# Altium schematic sheet 31.SchDoc
size 513 x 386 mm
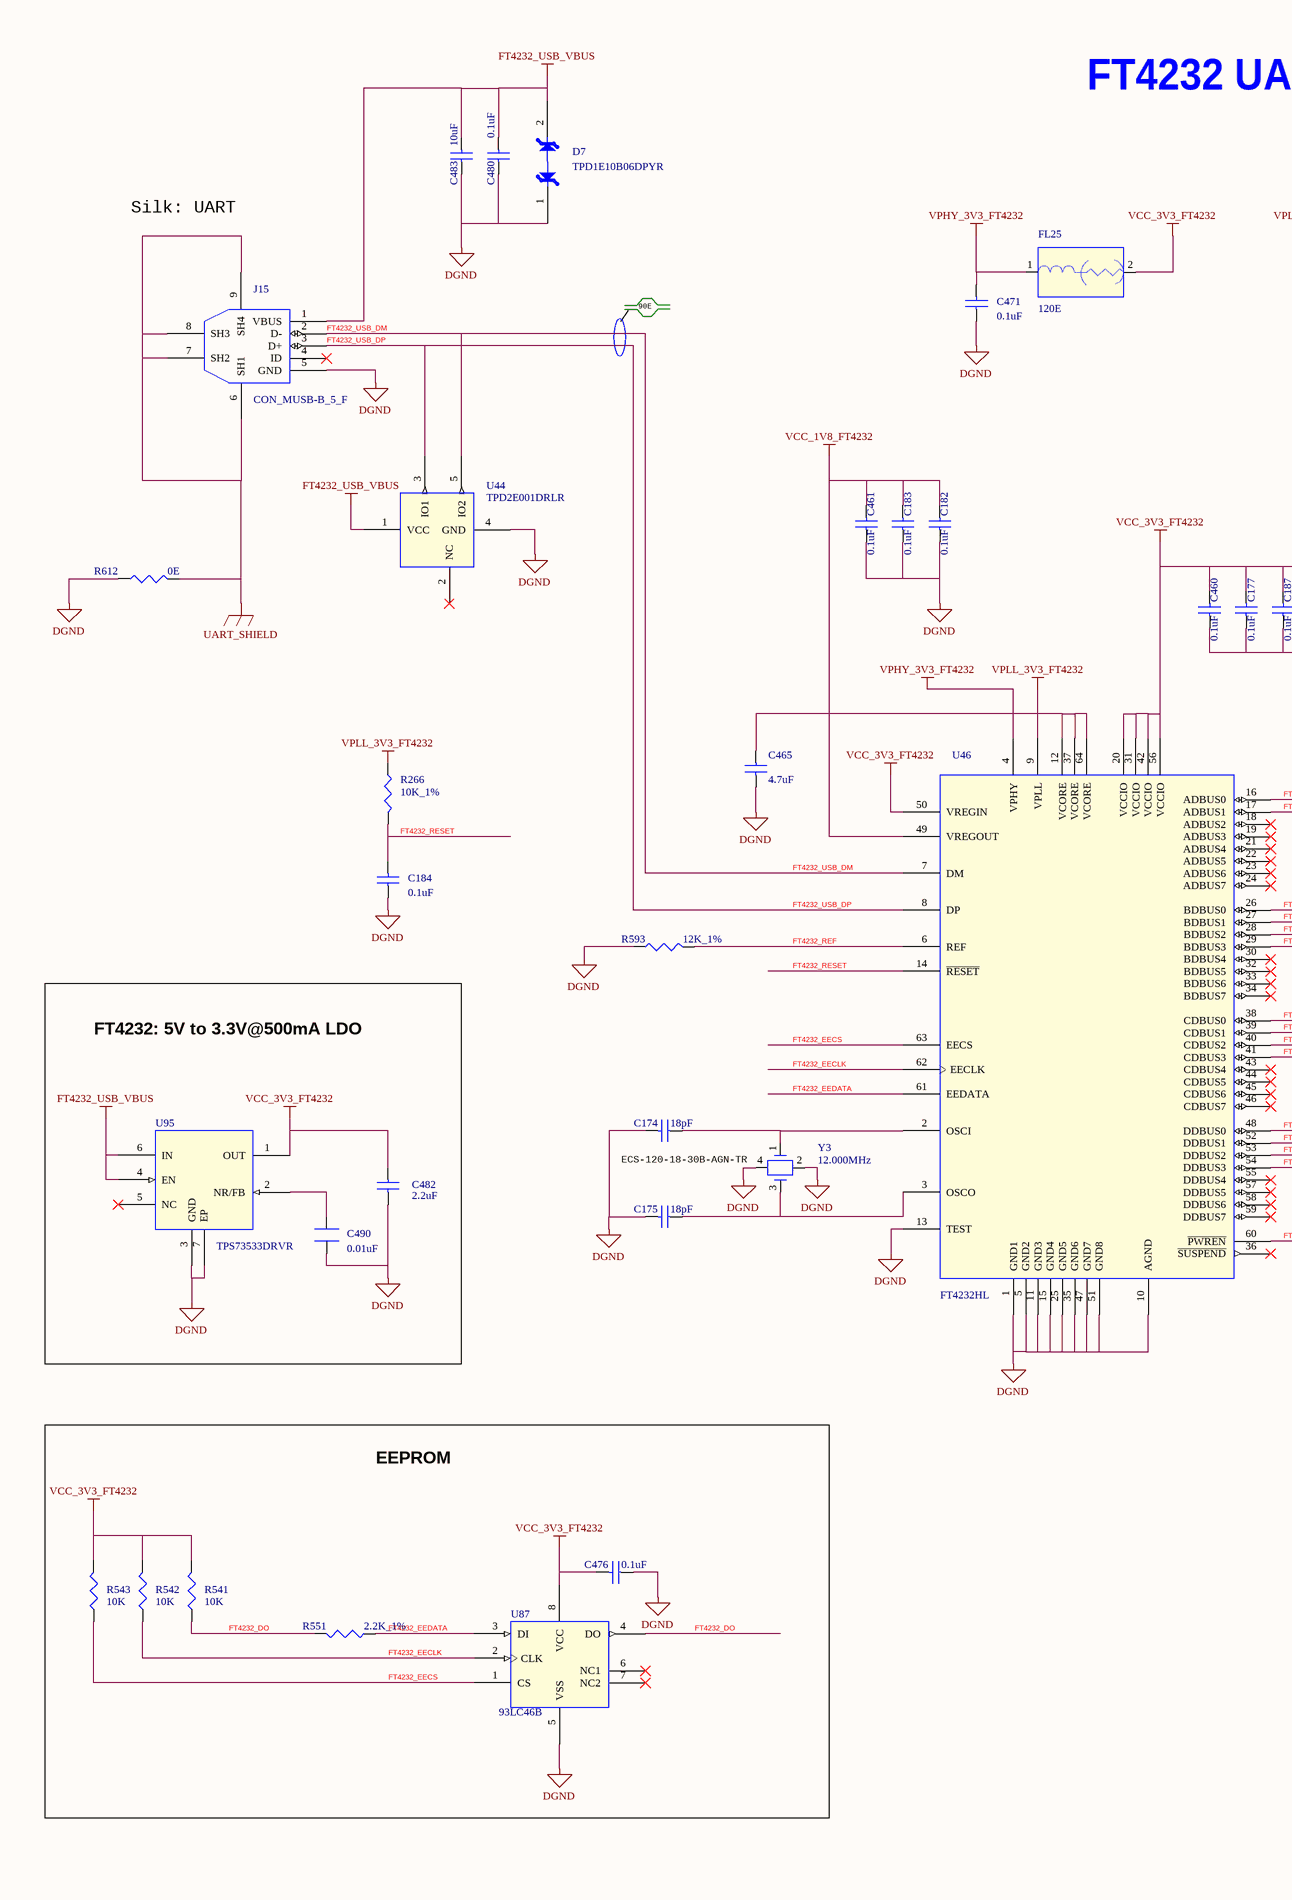
[diagram p0: 31.SchDoc, left]
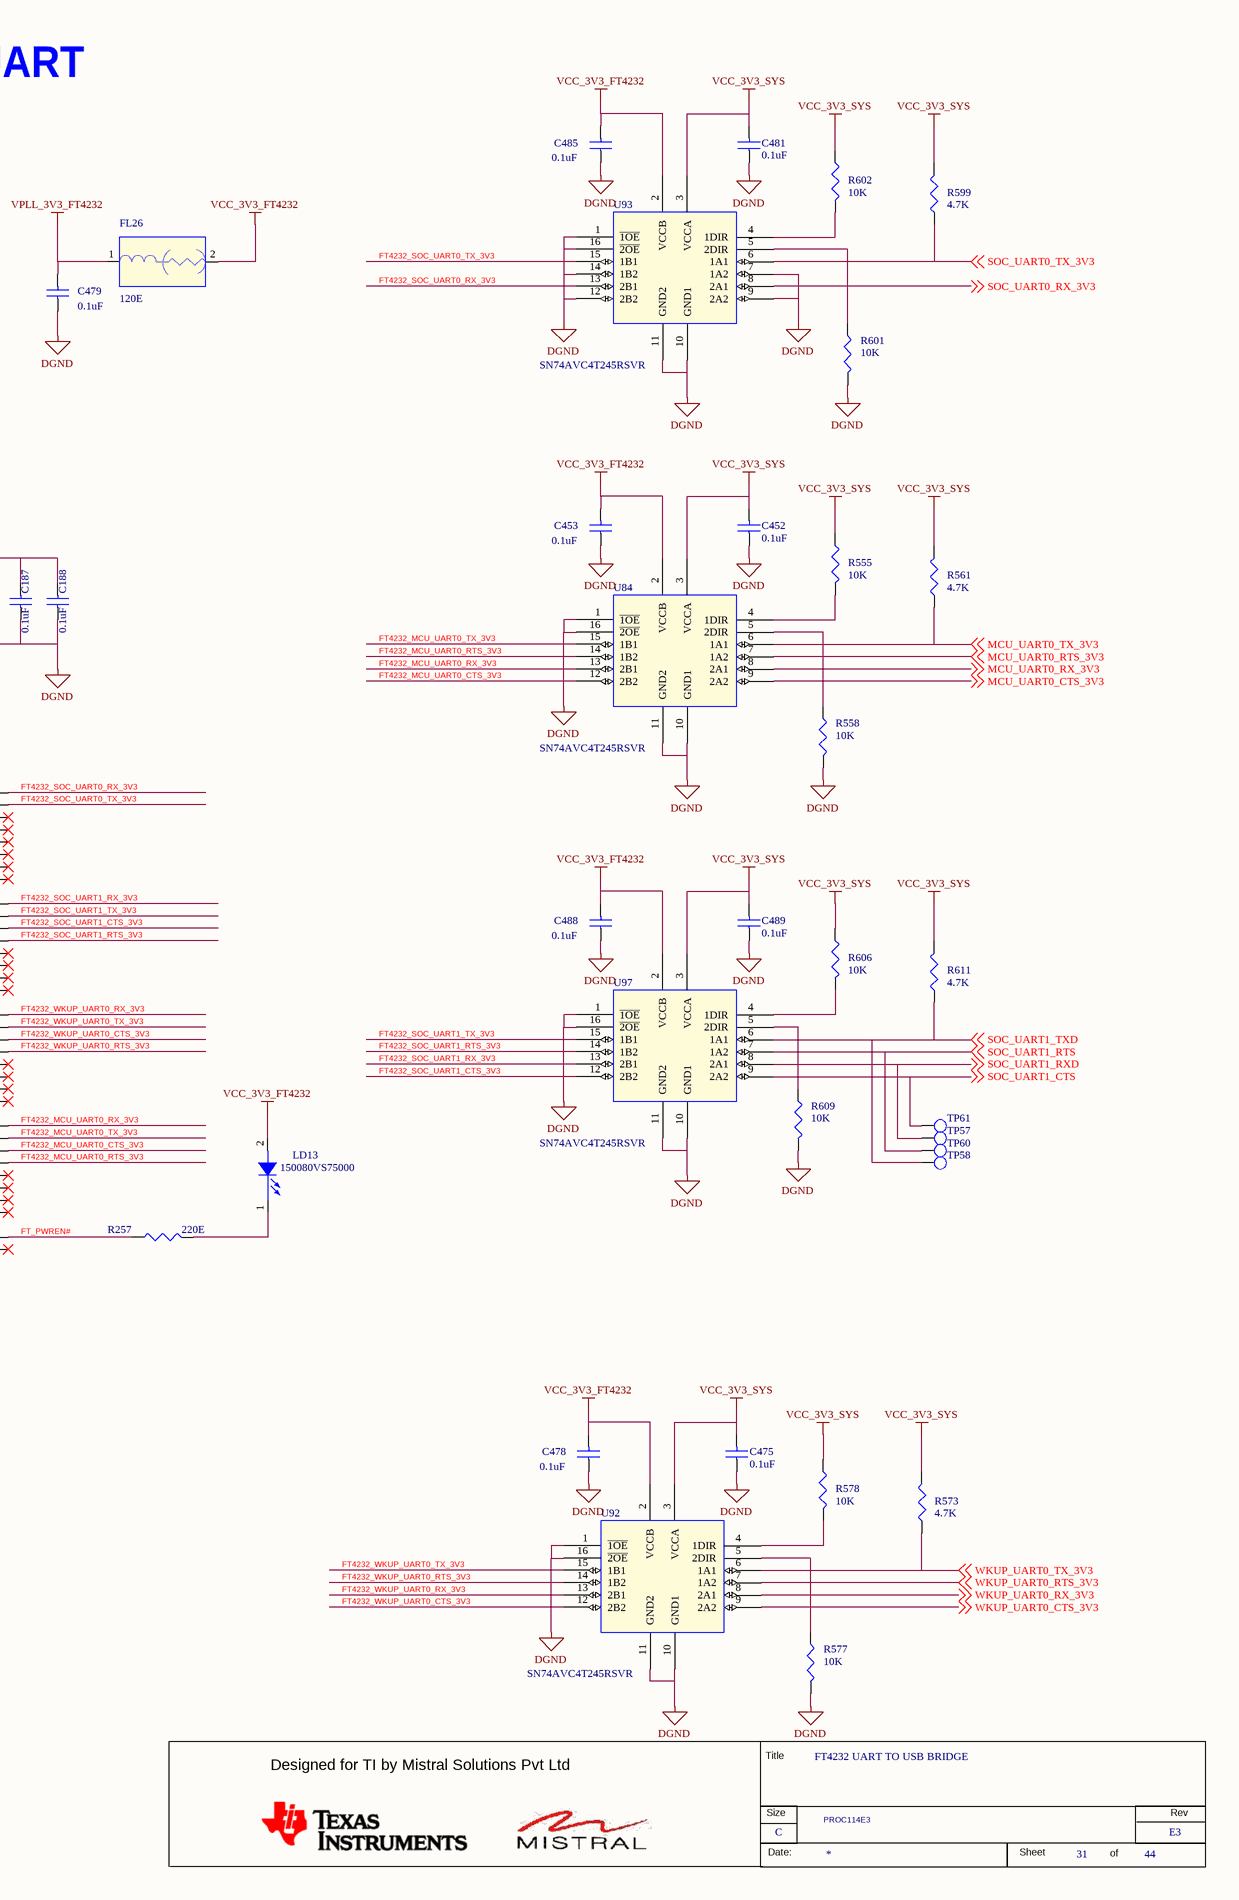
[diagram p1: 31.SchDoc, right]

## Parts
*  RevCode: E3  Title: FT4232 UART TO USB BRIDGE  Page Size: C  Page Number: 31  Page Count: 44  Variant Name: PROC114E3  (hidden comment: MISTRAL_TITLEBLK_CSIZE)  (graphical)
C174  18pF  [CAP0402_0-75]
C175  18pF  [CAP0402_0-75]
C177  0.1uF  [CAP0402_0-75]
C182  0.1uF  [CAP0402_0-75]
C183  0.1uF  [CAP0402_0-75]
C184  0.1uF  [CAP0201_0-5]
C187  0.1uF  [CAP0402_0-75]
C188  0.1uF  [CAP0402_0-75]
C452  0.1uF  [CAP0201_0-5]
C453  0.1uF  [CAP0201_0-5]
C460  0.1uF  [CAP0402_0-75]
C461  0.1uF  [CAP0402_0-75]
C465  4.7uF  [CAP0402_0-75]
C471  0.1uF  [CAP0402_0-75]
C475  0.1uF  [CAP0201_0-5]
C476  0.1uF  [CAP0402_0-75]
C478  0.1uF  [CAP0201_0-5]
C479  0.1uF  [CAP0402_0-75]
C480  0.1uF  [CAP0402_0-75]
C481  0.1uF  [CAP0201_0-5]
C482  2.2uF  [CAP0402_0-75]
C483  10uF  [CAP0402_0-75]
C485  0.1uF  [CAP0201_0-5]
C488  0.1uF  [CAP0201_0-5]
C489  0.1uF  [CAP0201_0-5]
C490  0.01uF  [CAP0402N]
D7  TPD1E10B06DPYR  [DIO_DFN0402_0-5]
FL25  120E  [EMIFIL_BLM15A_0402_0-6]
FL26  120E  [EMIFIL_BLM15A_0402_0-6]
J15  CON_MUSB-B_5_F  [CON_MUSBB5_629105150521_S_R_S_2-7]
LD13  150080VS75000  [LED_150080VS75000_80X50_SMD_0-8]
R257  220E  [RES0402_0-5]
R266  10K_1%  [RES0402N]
R541  10K  [RES0201_0-5]
R542  10K  [RES0201_0-5]
R543  10K  [RES0201_0-5]
R551  2.2K_1%  [RES0201_0-5]
R555  10K  [RES0201_0-5]
R558  10K  [RES0201_0-5]
R561  4.7K  [RES0201_0-5]
R573  4.7K  [RES0201_0-5]
R577  10K  [RES0201_0-5]
R578  10K  [RES0201_0-5]
R593  12K_1%  [RES0402_0-5]
R599  4.7K  [RES0201_0-5]
R601  10K  [RES0201_0-5]
R602  10K  [RES0201_0-5]
R606  10K  [RES0201_0-5]
R609  10K  [RES0201_0-5]
R611  4.7K  [RES0201_0-5]
R612  0E  [RES0805_0-75]
TP57  THRU HOLE  [TP_36X22]  (value not drawn)
TP58  THRU HOLE  [TP_36X22]  (value not drawn)
TP60  TP20_SMD  [TP20_SMD]  (value not drawn)
TP61  TP20_SMD  [TP20_SMD]  (value not drawn)
U44  TPD2E001DRLR  [SOT553-5_0-6]
U46  FT4232HL  [LQF64]
U84  SN74AVC4T245RSVR  [UQFN16_TMUX1574_70X100_0-6]
U87  93LC46B  [MSOP8_25-59_125X125_1-1]
U92  SN74AVC4T245RSVR  [UQFN16_TMUX1574_70X100_0-6]
U93  SN74AVC4T245RSVR  [UQFN16_TMUX1574_70X100_0-6]
U95  TPS73533DRVR  [SON6_25-59_85X85]
U97  SN74AVC4T245RSVR  [UQFN16_TMUX1574_70X100_0-6]
Y3  12.000MHz  [XTAL4_ECX-53BQ_200X130_SMD_0-9]

## Blocks framed on the sheet
FT4232: 5V to 3.3V@500mA LDO: C482 C490 U95
EEPROM: C476 R541-R543 R551 U87

## Nets
DGND: C174.2 C175.2 C177.1 C182.1 C183.1 C184.1 C187.1 C188.1 C452.1 C453.1 C460.1 C461.1 C465.2 C471.1 C475.1 C476.1 C478.1 C479.1 C480.1 C481.1 C482.2 C483.1 C485.1 C488.1 C489.1 C490.1 D7.1 J15.5(GND) R558.1 R577.1 R593.1 R601.1 R609.1 R612.1 U44.4(GND) U46.1(GND1) U46.5(GND2) U46.10(AGND) U46.11(GND3) U46.13(TEST) U46.15(GND4) U46.25(GND5) U46.35(GND6) U46.47(GND7) U46.51(GND8) U84.1(~{1OE}) U84.10(GND1) U84.11(GND2) U84.16(~{2OE}) U87.5(VSS) U92.1(~{1OE}) U92.10(GND1) U92.11(GND2) U92.16(~{2OE}) U93.1(~{1OE}) U93.7(1A2) U93.9(2A2) U93.10(GND1) U93.11(GND2) U93.12(2B2) U93.14(1B2) U93.16(~{2OE}) U95.3(GND) U95.7(EP) U97.1(~{1OE}) U97.10(GND1) U97.11(GND2) U97.16(~{2OE}) Y3.2 Y3.4
FT4232_USB_VBUS: C480.2 C483.2 D7.2 J15.1(VBUS) U44.1(VCC) U95.4(EN) U95.6(IN)
UART_SHIELD: J15.6(SH1) J15.7(SH2) J15.8(SH3) J15.9(SH4) R612.2
VCC_1V8_FT4232: C182.2 C183.2 C461.2 C465.1 U46.12(VCORE) U46.37(VCORE) U46.49(VREGOUT) U46.64(VCORE)
VCC_3V3_FT4232: C177.2 C187.2 C188.2 C453.2 C460.2 C476.2 C478.2 C482.1 C485.2 C488.2 FL25.2 FL26.2 LD13.2(ANODE) R541.2 R542.2 R543.2 U46.20(VCCIO) U46.31(VCCIO) U46.42(VCCIO) U46.50(VREGIN) U46.56(VCCIO) U84.2(VCCB) U87.8(VCC) U92.2(VCCB) U93.2(VCCB) U95.1(OUT) U97.2(VCCB)
VCC_3V3_SYS: C452.2 C475.2 C481.2 C489.2 R555.2 R561.1 R573.1 R578.2 R599.1 R602.2 R606.2 R611.1 U84.3(VCCA) U92.3(VCCA) U93.3(VCCA) U97.3(VCCA)
VPHY_3V3_FT4232: C471.2 FL25.1 U46.4(VPHY)
VPLL_3V3_FT4232: C479.2 FL26.1 R266.2 U46.9(VPLL)
FT4232_DO: R541.1 R551.2 U87.4(DO)
FT4232_EECLK: R542.1 U46.62(EECLK) U87.2(CLK)
FT4232_EECS: R543.1 U46.63(EECS) U87.1(CS)
FT4232_EEDATA: R551.1 U46.61(EEDATA) U87.3(DI)
FT4232_MCU_UART0_CTS_3V3: U46.53(DDBUS2) U84.12(2B2)
FT4232_MCU_UART0_RTS_3V3: U46.54(DDBUS3) U84.14(1B2)
FT4232_MCU_UART0_RX_3V3: U46.48(DDBUS0) U84.13(2B1)
FT4232_MCU_UART0_TX_3V3: U46.52(DDBUS1) U84.15(1B1)
FT4232_REF: R593.2 U46.6(REF)
FT4232_RESET: C184.2 R266.1 U46.14(~{RESET})
FT4232_SOC_UART0_RX_3V3: U46.16(ADBUS0) U93.13(2B1)
FT4232_SOC_UART0_TX_3V3: U46.17(ADBUS1) U93.15(1B1)
FT4232_SOC_UART1_CTS_3V3: U46.28(BDBUS2) U97.12(2B2)
FT4232_SOC_UART1_RTS_3V3: U46.29(BDBUS3) U97.14(1B2)
FT4232_SOC_UART1_RX_3V3: U46.26(BDBUS0) U97.13(2B1)
FT4232_SOC_UART1_TX_3V3: U46.27(BDBUS1) U97.15(1B1)
FT4232_USB_DM: J15.2(D-) U44.5(IO2) U46.7(DM)
FT4232_USB_DP: J15.3(D+) U44.3(IO1) U46.8(DP)
FT4232_WKUP_UART0_CTS_3V3: U46.40(CDBUS2) U92.12(2B2)
FT4232_WKUP_UART0_RTS_3V3: U46.41(CDBUS3) U92.14(1B2)
FT4232_WKUP_UART0_RX_3V3: U46.38(CDBUS0) U92.13(2B1)
FT4232_WKUP_UART0_TX_3V3: U46.39(CDBUS1) U92.15(1B1)
FT_PWREN#: R257.1 U46.60(~{PWREN})
MCU_UART0_CTS_3V3: U84.9(2A2) ; off-sheet MCU_UART0_CTS_3V3
MCU_UART0_RTS_3V3: U84.7(1A2) ; off-sheet MCU_UART0_RTS_3V3
MCU_UART0_RX_3V3: U84.8(2A1) ; off-sheet MCU_UART0_RX_3V3
MCU_UART0_TX_3V3: R561.2 U84.6(1A1) ; off-sheet MCU_UART0_TX_3V3
SOC_UART0_RX_3V3: U93.8(2A1) ; off-sheet SOC_UART0_RX_3V3
SOC_UART0_TX_3V3: R599.2 U93.6(1A1) ; off-sheet SOC_UART0_TX_3V3
SOC_UART1_CTS: TP61.1(TP) U97.9(2A2) ; off-sheet SOC_UART1_CTS
SOC_UART1_RTS: TP60.1(TP) U97.7(1A2) ; off-sheet SOC_UART1_RTS
SOC_UART1_RXD: TP57.1(TP) U97.8(2A1) ; off-sheet SOC_UART1_RXD
SOC_UART1_TXD: R611.2 TP58.1(TP) U97.6(1A1) ; off-sheet SOC_UART1_TXD
WKUP_UART0_CTS_3V3: U92.9(2A2) ; off-sheet WKUP_UART0_CTS_3V3
WKUP_UART0_RTS_3V3: U92.7(1A2) ; off-sheet WKUP_UART0_RTS_3V3
WKUP_UART0_RX_3V3: U92.8(2A1) ; off-sheet WKUP_UART0_RX_3V3
WKUP_UART0_TX_3V3: R573.2 U92.6(1A1) ; off-sheet WKUP_UART0_TX_3V3
NetC174_1: C174.1 U46.2(OSCI) Y3.1
NetC175_1: C175.1 U46.3(OSCO) Y3.3
NetC490_2: C490.2 U95.2(NR/FB)
NetLD13_1: LD13.1(CATHODE) R257.2
NetR555_1: R555.1 U84.4(1DIR)
NetR558_2: R558.2 U84.5(2DIR)
NetR577_2: R577.2 U92.5(2DIR)
NetR578_1: R578.1 U92.4(1DIR)
NetR601_2: R601.2 U93.5(2DIR)
NetR602_1: R602.1 U93.4(1DIR)
NetR606_1: R606.1 U97.4(1DIR)
NetR609_2: R609.2 U97.5(2DIR)

Not connected (* = marked no-connect by the designer): J15 4(ID)*; U44 2(NC)*; U46 18(ADBUS2)* 19(ADBUS3)* 21(ADBUS4)* 22(ADBUS5)* 23(ADBUS6)* 24(ADBUS7)* 30(BDBUS4)* 32(BDBUS5)* 33(BDBUS6)* 34(BDBUS7)* 36(~{SUSPEND})* 43(CDBUS4)* 44(CDBUS5)* 45(CDBUS6)* 46(CDBUS7)* 55(DDBUS4)* 57(DDBUS5)* 58(DDBUS6)* 59(DDBUS7)*; U87 6(NC1)* 7(NC2)*; U95 5(NC)*

## Notes on the sheet
- FT4232 UART
- Silk: UART
- 90E
- ECS-120-18-30B-AGN-TR
- (in symbol MISTRAL_TITLEBLK_CSIZE) Title; Designed for TI by Mistral Solutions Pvt Ltd; Size; Rev; Date:; Sheet; of

## Library data of the parts
* = MISTRAL_TITLEBLK_CSIZE: Issue: 1.0; Page Create Date: March  8, 1995; Page Modify Date: *; Schematic Page Count: 44; Schematic Page Number: 31
C174 = CAP_Dup2: CAP CERAMIC 18pF 50V 5% HI-Q C0G(NP0) 0402; Part_type: CAPACITORS\CERAMIC; Mfr_part_number: GJM1555C1H180JB01D; Mfr_name: MURATA; Mistral Part No: 120014100019-R; Custom_Duty: 15%; Customs_HS_Code: 85322990; Project: DC_MIST_RDC; Wattage: NA; Footprint Path: Y:\MIS_DATABASE\Library\ALTIUM_TOOL\PCB_FOOTPRINTS\Altium_Footprint_Lib.PcbLib; Library Path: Y:\MIS_DATABASE\Library\ALTIUM_TOOL\SCHEMATICS_PARTS\MS_DISCRETE_Library.schlib; MECHANICAL 3D STEP FILE: CAP0402_0-75; Footprint Ref: CAP0402_0-75; Library Ref: CAP; Chkd/date: VASANTHA/030315; Crtd /date: NAVEED/271014; Datasheet: Y:\MIS_DATABASE\DATASHEETS\CAPACITORS\MURATA-GXX-SER_NOV17.PDF; Height: 0.55MM; Distributor_part_number: 490-3119-1-ND; Distributor_name: DIGIKEY; Package: 0402; Voltage: 50V; Tolerance: 5%; Weight: 6mg; Temperature: -55°C+125°C; PCB Footprint: CAP0402_0-75
C175 = CAP_Dup2: CAP CERAMIC 18pF 50V 5% HI-Q C0G(NP0) 0402; Mistral Part No: 120014100019-R; Mfr_name: MURATA; Mfr_part_number: GJM1555C1H180JB01D; Part_type: CAPACITORS\CERAMIC; Project: DC_MIST_RDC; Customs_HS_Code: 85322990; Custom_Duty: 15%; Wattage: NA; Footprint Path: Y:\MIS_DATABASE\Library\ALTIUM_TOOL\PCB_FOOTPRINTS\Altium_Footprint_Lib.PcbLib; Library Path: Y:\MIS_DATABASE\Library\ALTIUM_TOOL\SCHEMATICS_PARTS\MS_DISCRETE_Library.schlib; MECHANICAL 3D STEP FILE: CAP0402_0-75; Footprint Ref: CAP0402_0-75; Library Ref: CAP; Tolerance: 5%; Voltage: 50V; Package: 0402; Distributor_name: DIGIKEY; Distributor_part_number: 490-3119-1-ND; Height: 0.55MM; Datasheet: Y:\MIS_DATABASE\DATASHEETS\CAPACITORS\MURATA-GXX-SER_NOV17.PDF; Crtd /date: NAVEED/271014; Chkd/date: VASANTHA/030315; Weight: 6mg; Temperature: -55°C+125°C; PCB Footprint: CAP0402_0-75
C177 C183 C188 C461 C471 C476 C479 C480 = CAP_Dup2: CAP CERAMIC 0.1uF 50V 10% X7R 0402; Alt_Mfr_part_number: CC0402KRX5R8BB104; Mistral Part No: 120011100014-R; Mfr_name: MURATA; Mfr_part_number: GRM155R71H104KE14D; Part_type: CAPACITORS\CERAMIC; Alt_Mfr_name: YAGEO AMERICA; Project: J7_CP; Wattage: NA; Customs_HS_Code: 85322990; Custom_Duty: 15%; Tolerance: 10%; Voltage: 50V; Package: 0402; Distributor_name: DIGIKEY; Distributor_part_number: 490-10700-1-ND; Height: 0.55MM; Weight: 3.1mg; Temperature: -55°C+125°C; Datasheet: Y:\MIS_DATABASE\DATASHEETS\CAPACITORS\GRM155R71H104KE14.PDF; Crtd /date: ALVY/211020; Chkd/date: MANIRAJA/261020; MECHANICAL 3D STEP FILE: CAP0402_0-75; Library Ref: CAP; Footprint Ref: CAP0402_0-75; Library Path: Y:\MIS_DATABASE\Library\ALTIUM_TOOL\SCHEMATICS_PARTS\MS_DISCRETE_Library.schlib; Footprint Path: Y:\MIS_DATABASE\Library\ALTIUM_TOOL\PCB_FOOTPRINTS\Altium_Footprint_Lib.PcbLib; PCB Footprint: CAP0402_0-75
C182 C187 C460 = CAP_Dup2: CAP CERAMIC 0.1uF 50V 10% X7R 0402; Alt_Mfr_name: YAGEO AMERICA; Part_type: CAPACITORS\CERAMIC; Mfr_part_number: GRM155R71H104KE14D; Mfr_name: MURATA; Mistral Part No: 120011100014-R; Alt_Mfr_part_number: CC0402KRX5R8BB104; Custom_Duty: 15%; Customs_HS_Code: 85322990; Wattage: NA; Project: J7_CP; Footprint Path: Y:\MIS_DATABASE\Library\ALTIUM_TOOL\PCB_FOOTPRINTS\Altium_Footprint_Lib.PcbLib; Library Path: Y:\MIS_DATABASE\Library\ALTIUM_TOOL\SCHEMATICS_PARTS\MS_DISCRETE_Library.schlib; Footprint Ref: CAP0402_0-75; Library Ref: CAP; MECHANICAL 3D STEP FILE: CAP0402_0-75; Chkd/date: MANIRAJA/261020; Crtd /date: ALVY/211020; Datasheet: Y:\MIS_DATABASE\DATASHEETS\CAPACITORS\GRM155R71H104KE14.PDF; Temperature: -55°C+125°C; Weight: 3.1mg; Height: 0.55MM; Distributor_part_number: 490-10700-1-ND; Distributor_name: DIGIKEY; Package: 0402; Voltage: 50V; Tolerance: 10%; PCB Footprint: CAP0402_0-75
C184 C475 C478 C488 C489 = CAP_Dup2: CAP CERAMIC 0.1uF 16V 10% X5R 0201; Alt_Mfr_name: YAGEO AMERICA; Part_type: CAPACITORS\CERAMIC; Mfr_part_number: GRM033R61C104KE14D; Mfr_name: MURATA; Mistral Part No: 120009030072-R; Alt_Mfr_part_number: CC0402KRX5R8BB104; Custom_Duty: 15%; Customs_HS_Code: 85322990; Wattage: NA; Project: TI_MAXIE_CPB; Footprint Path: Y:\MIS_DATABASE\Library\ALTIUM_TOOL\PCB_FOOTPRINTS\Altium_Footprint_Lib.PcbLib; Library Path: Y:\MIS_DATABASE\Library\ALTIUM_TOOL\SCHEMATICS_PARTS\MS_DISCRETE_Library.schlib; Footprint Ref: CAP0201_0-5; Library Ref: CAP; MECHANICAL 3D STEP FILE: CAP0201_0-5; Chkd/date: MANIRAJA/230118; Crtd /date: MANIRAJA/230118; Datasheet: Y:\MIS_DATABASE\DATASHEETS\CAPACITORS\GRM033R61C104KE14.PDF; Temperature: -55°C+85°C; Weight: 0.33mg; Height: 0.33MM; Distributor_part_number: 490-14305-1-ND; Distributor_name: DIGIKEY; Package: 0201; Voltage: 16V; Tolerance: 10%; PCB Footprint: CAP0201_0-5
C452 C453 C481 C485 = CAP_Dup2: CAP CERAMIC 0.1uF 16V 10% X5R 0201; Alt_Mfr_part_number: CC0402KRX5R8BB104; Mistral Part No: 120009030072-R; Mfr_name: MURATA; Mfr_part_number: GRM033R61C104KE14D; Part_type: CAPACITORS\CERAMIC; Alt_Mfr_name: YAGEO AMERICA; Project: TI_MAXIE_CPB; Wattage: NA; Customs_HS_Code: 85322990; Custom_Duty: 15%; Tolerance: 10%; Voltage: 16V; Package: 0201; Distributor_name: DIGIKEY; Distributor_part_number: 490-14305-1-ND; Height: 0.33MM; Weight: 0.33mg; Temperature: -55°C+85°C; Datasheet: Y:\MIS_DATABASE\DATASHEETS\CAPACITORS\GRM033R61C104KE14.PDF; Crtd /date: MANIRAJA/230118; Chkd/date: MANIRAJA/230118; MECHANICAL 3D STEP FILE: CAP0201_0-5; Library Ref: CAP; Footprint Ref: CAP0201_0-5; Library Path: Y:\MIS_DATABASE\Library\ALTIUM_TOOL\SCHEMATICS_PARTS\MS_DISCRETE_Library.schlib; Footprint Path: Y:\MIS_DATABASE\Library\ALTIUM_TOOL\PCB_FOOTPRINTS\Altium_Footprint_Lib.PcbLib; PCB Footprint: CAP0201_0-5
C465 = CAP_Dup2: CAP CERAMIC 4.7uF 10V 20% X5R 0402; Part_type: CAPACITORS\CERAMIC; Mfr_part_number: GRM155R61A475MEAAD; Mfr_name: MURATA; Mistral Part No: 120012060002-R; Custom_Duty: 15%; Customs_HS_Code: 85322990; Wattage: NA; Project: TI_J7SVB_PCIE_ADD-ON-CARD; Footprint Path: Y:\MIS_DATABASE\Library\ALTIUM_TOOL\PCB_FOOTPRINTS\Altium_Footprint_Lib.PcbLib; Library Path: Y:\MIS_DATABASE\Library\ALTIUM_TOOL\SCHEMATICS_PARTS\MS_DISCRETE_Library.schlib; MECHANICAL 3D STEP FILE: CAP0402_0-75; Chkd/date: MANIRAJA/110718; Crtd /date: ALVY/110718; Datasheet: Y:\MIS_DATABASE\DATASHEETS\CAPACITORS\GRM155R61A475MEAAD.PDF; Temperature: -55°C+85°C; Weight: 14mg; Height: 0.65MM; Footprint Ref: CAP0402_0-75; Library Ref: CAP; Distributor_part_number: 490-14306-1-ND; Distributor_name: DIGIKEY; Package: 0402; Voltage: 10V; Tolerance: 20%; PCB Footprint: CAP0402_0-75
C482 = CAP_Dup2: CAP CERAMIC 2.2uF 25V 10% X5R 0402; Mistral Part No: 120015120001-R; Mfr_name: MURATA; Mfr_part_number: GRM155R61E225KE11D; Part_type: CAPACITORS\CERAMIC; Project: TI_AM263X_CC; Wattage: NA; Customs_HS_Code: 85322990; Custom_Duty: 15%; Footprint Path: Y:\MIS_DATABASE\Library\ALTIUM_TOOL\PCB_FOOTPRINTS\Altium_Footprint_Lib.PcbLib; Library Path: Y:\MIS_DATABASE\Library\ALTIUM_TOOL\SCHEMATICS_PARTS\MS_DISCRETE_Library.schlib; Footprint Ref: CAP0402_0-75; Library Ref: CAP; Tolerance: 10%; Voltage: 25V; Package: 0402; Distributor_name: DIGIKEY; Distributor_part_number: 490-12703-1-ND; Height: 0.70MM; Weight: 1.5mg; Temperature: -55°C+85°C; Datasheet: Y:\MIS_DATABASE\DATASHEETS\CAPACITORS\GRM155R61E225KE11.PDF; Crtd /date: MANIRAJA/010721; Chkd/date: ALVY/010721; MECHANICAL 3D STEP FILE: CAP0402_0-75; PCB Footprint: CAP0402_0-75
C483 = CAP_Dup2: CAP CERAMIC 10uF 10V 20% X5R 0402; Part_type: CAPACITORS\CERAMIC; Mfr_part_number: GRM155R61A106ME11D; Mfr_name: MURATA; Mistral Part No: 120013110019-R; Custom_Duty: 15%; Customs_HS_Code: 85322990; Project: QCS610_NANOSOM; Wattage: NA; Footprint Path: Y:\MIS_DATABASE\Library\ALTIUM_TOOL\PCB_FOOTPRINTS\Altium_Footprint_Lib.PcbLib; Library Path: Y:\MIS_DATABASE\Library\ALTIUM_TOOL\SCHEMATICS_PARTS\MS_DISCRETE_Library.schlib; Footprint Ref: CAP0402_0-75; Chkd/date: MANIRAJA/300520; Crtd /date: ALVY/260520; Datasheet: Y:\MIS_DATABASE\DATASHEETS\CAPACITORS\MURATA-GXX-SER_NOV17.PDF; Height: 0.55MM; Distributor_part_number: 490-GRM155R61A106ME11DTR-ND; Distributor_name: DIGIKEY; Package: 0402; Voltage: 10V; Tolerance: 20%; Weight: 3.1mg; Temperature: -55°C+85°C; MECHANICAL 3D STEP FILE: CAP0402_0-75; Library Ref: CAP; PCB Footprint: CAP0402_0-75
C490 = CAP_Dup3: CAP CERAMIC 0.01uF 25V 10% X5R 0201; Part_type: CAPACITORS\CERAMIC; Mfr_part_number: GRM033R61E103KA12J; Mfr_name: MURATA; Mistral Part No: 120018010007-R; MECHANICAL 3D STEP FILE: CAP0201_0-5; Wattage: NA; Custom_Duty: 15%; Customs_HS_Code: 85322990; Project: TI_MAXIE_CPB; Footprint Path: Y:\MIS_DATABASE\Library\ALTIUM_TOOL\PCB_FOOTPRINTS\Altium_Footprint_Lib.PcbLib; Library Path: Y:\MIS_DATABASE\Library\ALTIUM_TOOL\SCHEMATICS_PARTS\MS_DISCRETE_Library.schlib; Footprint Ref: CAP0201_0-5; Temperature: -55°C+85°C; Weight: 0.33mg; Chkd/date: MANIRAJA/230118; Crtd /date: MANIRAJA/230118; Datasheet: Y:\MIS_DATABASE\DATASHEETS\CAPACITORS\GRM033R61E103KA12.PDF; Height: 0.33MM; Distributor_part_number: GRM033R61E103KA12J-ND; Distributor_name: DIGIKEY; Package: 0201; Voltage: 25V; Tolerance: 10%; Library Ref: CAP; PCB Footprint: CAP0201_0-5
D7 = DIODE_SOD323: DIODE 1CH ESD PROTECTION X1SON2; Mistral Part No: 130014110022-R; Mfr_name: TEXAS INSTRUMENTS; Project: GALILEO_EVM; Tolerance: NA; Customs_HS_Code: 85423100; Custom_Duty: 15%; Footprint Ref: DIO_DFN0402_0-5; Mfr_part_number: TPD1E10B06DPYR; Part_type: DIODE; Voltage: NA; Wattage: NA; Package: X1SON2; Distributor_name: DIGIKEY; Distributor_part_number: 296-30406-1-ND; Library Ref: DIODE_SOD323; Height: 0.45MM; Weight: 1mg; Temperature: -40°C+125°C; Datasheet: Y:\MIS_DATABASE\DATASHEETS\ICS\INTERFACE\TPD1E10B06-SER.PDF; Crtd /date: VASANTHA/181114; Chkd/date: MANIRAJA/040420; MECHANICAL 3D STEP FILE: DIO_DFN0402_0-5; Library Path: Y:\MIS_DATABASE\Library\ALTIUM_TOOL\SCHEMATICS_PARTS\MS_DISCRETE_Library.schlib; Footprint Path: Y:\MIS_DATABASE\Library\ALTIUM_TOOL\PCB_FOOTPRINTS\Altium_Footprint_Lib.PcbLib; PCB Footprint: DIO_DFN0402_0-5
FL25 FL26 = EMIFILTER_IND: IND FERRITE BEAD CHIP 120E 2A 0402; Part_type: INDUCTOR; Mfr_part_number: BLM15PX121SN1D; Mfr_name: MURATA; Mistral Part No: 130013060022-R; Custom_Duty: 24%; Customs_HS_Code: 85369090; Wattage: NA; Tolerance: 25%; Project: GEN_3-8; Footprint Path: Y:\MIS_DATABASE\Library\ALTIUM_TOOL\PCB_FOOTPRINTS\Altium_Footprint_Lib.PcbLib; Library Path: Y:\MIS_DATABASE\Library\ALTIUM_TOOL\SCHEMATICS_PARTS\MS_FILTER_Library.schlib; MECHANICAL 3D STEP FILE: EMIFIL_BLM15A_0402_0-6; Chkd/date: NAVEED/241114; Crtd /date: USMAN/170613; Datasheet: Y:\MIS_DATABASE\DATASHEETS\DISCRETES\INDUCTORS\BLM15-SN1-SER.PDF; Temperature: -55°C+125°C; Weight: 1mg; Height: 0.55MM; Library Ref: EMIFILTER_IND; Distributor_part_number: 490-9656-1-ND; Distributor_name: DIGIKEY; Package: 0402; Voltage: NA; Footprint Ref: EMIFIL_BLM15A_0402_0-6; PCB Footprint: EMIFIL_BLM15A_0402_0-6
J15 = CON_USB_MINI-B: CON MICRO USB TYPE B 5POS FEMALE RT SMD; Part_type: CONNECTOR\USB; Mfr_part_number: 629105150521; Mfr_name: WURTH ELECTRONICS; Mistral Part No: 150019050015-R; Custom_Duty: 24%; Customs_HS_Code: 85369090; Wattage: NA; Project: NEXTNAV_ALT-STATION_ATE_BRD; Footprint Path: Y:\MIS_DATABASE\Library\ALTIUM_TOOL\PCB_FOOTPRINTS\Altium_Footprint_Lib.PcbLib; Library Path: Y:\MIS_DATABASE\Library\ALTIUM_TOOL\SCHEMATICS_PARTS\MS_CONNECTOR_Library.schlib; MECHANICAL 3D STEP FILE: CON_MUSBB5_629105150521_S_R_S_2-7; Chkd/date: MANIRAJA/150519; Crtd /date: ALVY/150519; Datasheet: Y:\MIS_DATABASE\DATASHEETS\CONNECTORS\629105150521.PDF; Temperature: -40°C+85°C; Weight: 360mg; Height: 2.66MM; Footprint Ref: CON_MUSBB5_629105150521_S_R_S_2-7; Library Ref: CON_USB_MINI-B; Distributor_part_number: 732-5960-1-ND; Distributor_name: DIGIKEY; Package: SMD; Voltage: NA; Tolerance: NA; PCB Footprint: CON_MUSBB5_629105150521_S_R_S_2-7
LD13 = DIODE_LED: DIODE LED BRIGHT GREEN SMD; Mistral Part No: 130020080012-R; Mfr_name: WURTH ELECTRONICS; Part_type: OPTO\LED; Project: AM64x_EVM_BRD; Tolerance: NA; Customs_HS_Code: 85439000; Custom_Duty: 24%; Footprint Ref: LED_150080VS75000_80X50_SMD_0-8; Mfr_part_number: 150080VS75000; Voltage: NA; Wattage: NA; Package: SMD; Distributor_name: DIGIKEY; Distributor_part_number: 732-4986-1-ND; Library Ref: DIODE_LED; Height: 0.80MM; Weight: 10mg; Temperature: -40°C+85°C; Datasheet: Y:\MIS_DATABASE\DATASHEETS\DISCRETES\LEDS\150080VS75000.PDF; Crtd /date: ALVY/180820; Chkd/date: MANIRAJA/180820; MECHANICAL 3D STEP FILE: LED_150080VS75000_80X50_SMD_0-8; Library Path: Y:\MIS_DATABASE\Library\ALTIUM_TOOL\SCHEMATICS_PARTS\MS_OPTO_Library.schlib; Footprint Path: Y:\MIS_DATABASE\Library\ALTIUM_TOOL\PCB_FOOTPRINTS\Altium_Footprint_Lib.PcbLib; PCB Footprint: LED_150080VS75000_80X50_SMD_0-8
R257 = RESISTOR_Dup6: RES 220E 1/10W 5% 0402; Part_type: RESISTORS\FIXED; Mfr_part_number: ERJ-2GEJ221X; Mfr_name: PANASONIC-ECG; Mistral Part No: 110009030506-R; Voltage: NA; Custom_Duty: 15%; Customs_HS_Code: 85332119; Project: RED EYE; Footprint Ref: RES0402_0-5; Footprint Path: Y:\MIS_DATABASE\Library\ALTIUM_TOOL\PCB_FOOTPRINTS\Altium_Footprint_Lib.PcbLib; Library Path: Y:\MIS_DATABASE\Library\ALTIUM_TOOL\SCHEMATICS_PARTS\MS_DISCRETE_Library.schlib; MECHANICAL 3D STEP FILE: RES0402_0-5; Temperature: -55°C+155°C; Weight: 0.8mg; Chkd/date: VASANTHA/291216; Crtd /date: GEETHA/260406; Datasheet: Y:\MIS_DATABASE\DATASHEETS\RESISTORS\PAN-ERJSER_NOV17.PDF; Height: 0.40MM; Distributor_part_number: P220JCT-ND; Distributor_name: DIGIKEY; Package: 0402; Wattage: 1/10W; Tolerance: 5%; Library Ref: RESISTOR; PCB Footprint: RES0402_0-5
R266 = RESISTOR_Dup3: RES 10K 1/20W 1% 0201; Part_type: RESISTORS\FIXED; Mfr_part_number: RC0201FR-0710KL; Mfr_name: YAGEO AMERICA; Mistral Part No: 110011040018-R; Custom_Duty: 15%; Customs_HS_Code: 85332119; Project: GOLDEN-I LITE; Voltage: NA; MECHANICAL 3D STEP FILE: RES0201_0-5; Footprint Path: Y:\MIS_DATABASE\Library\ALTIUM_TOOL\PCB_FOOTPRINTS\Altium_Footprint_Lib.PcbLib; Library Path: Y:\MIS_DATABASE\Library\ALTIUM_TOOL\SCHEMATICS_PARTS\MS_DISCRETE_Library.schlib; Footprint Ref: RES0201_0-5; Library Ref: RESISTOR; Chkd/date: VASANTHA/270117; Crtd /date: MANIRAJA/270117; Datasheet: Y:\MIS_DATABASE\DATASHEETS\RESISTORS\RCXXXXL-SER_MAR18.PDF; Height: 0.26MM; Distributor_part_number: 311-10.0KMCT-ND; Distributor_name: DIGIKEY; Package: 0201; Wattage: 1/20W; Tolerance: 1%; Weight: 0.17mg; Temperature: -55°C+125°C; PCB Footprint: RES0201_0-5
R541 R542 R555 R577 R601 R602 = RESISTOR_Dup6: RES 10K 1/20W 5% 0201; Mistral Part No: 110010070051-R; Mfr_name: YAGEO AMERICA; Mfr_part_number: RC0201JR-0710KL; Part_type: RESISTORS\FIXED; Project: GOLDEN-I LITE; Voltage: NA; Customs_HS_Code: 85332119; Custom_Duty: 15%; Tolerance: 5%; Wattage: 1/20W; Package: 0201; Distributor_name: DIGIKEY; Distributor_part_number: 311-10KNCT-ND; Height: 0.26MM; Weight: 0.17mg; Temperature: -55°C+125°C; Datasheet: Y:\MIS_DATABASE\DATASHEETS\RESISTORS\RCXXXXL-SER_MAR18.PDF; Crtd /date: MANIRAJA/050517; Chkd/date: MANIRAJA/050517; MECHANICAL 3D STEP FILE: RES0201_0-5; Library Ref: RESISTOR; Footprint Ref: RES0201_0-5; Library Path: Y:\MIS_DATABASE\Library\ALTIUM_TOOL\SCHEMATICS_PARTS\MS_DISCRETE_Library.schlib; Footprint Path: Y:\MIS_DATABASE\Library\ALTIUM_TOOL\PCB_FOOTPRINTS\Altium_Footprint_Lib.PcbLib; PCB Footprint: RES0201_0-5
R543 R558 R578 R606 R609 = RESISTOR_Dup6: RES 10K 1/20W 5% 0201; Part_type: RESISTORS\FIXED; Mfr_part_number: RC0201JR-0710KL; Mfr_name: YAGEO AMERICA; Mistral Part No: 110010070051-R; Custom_Duty: 15%; Customs_HS_Code: 85332119; Voltage: NA; Project: GOLDEN-I LITE; MECHANICAL 3D STEP FILE: RES0201_0-5; Chkd/date: MANIRAJA/050517; Crtd /date: MANIRAJA/050517; Datasheet: Y:\MIS_DATABASE\DATASHEETS\RESISTORS\RCXXXXL-SER_MAR18.PDF; Temperature: -55°C+125°C; Weight: 0.17mg; Height: 0.26MM; Distributor_part_number: 311-10KNCT-ND; Distributor_name: DIGIKEY; Package: 0201; Wattage: 1/20W; Tolerance: 5%; Library Ref: RESISTOR; Footprint Ref: RES0201_0-5; Library Path: Y:\MIS_DATABASE\Library\ALTIUM_TOOL\SCHEMATICS_PARTS\MS_DISCRETE_Library.schlib; Footprint Path: Y:\MIS_DATABASE\Library\ALTIUM_TOOL\PCB_FOOTPRINTS\Altium_Footprint_Lib.PcbLib; PCB Footprint: RES0201_0-5
R551 = RESISTOR_Dup6: RES 2.2K 1/20W 1% 0201; Manufacturer: YAGEO AMERICA; Mistral Part No: 110017010016-R; Mfr_name: PANASONIC-ECG; Mfr_part_number: RC0201FR-072K2L; Part_type: RESISTORS\FIXED; Project: GOLDEN-I LITE; Voltage: NA; Customs_HS_Code: 85332119; Custom_Duty: 15%; Library Ref: RESISTOR; Tolerance: 1%; Wattage: 1/20W; Package: 0201; Distributor_name: DIGIKEY; Distributor_part_number: YAG2572CT-ND; Height: 0.26MM; Weight: 0.17mg; Temperature: -55°C+125°C; Datasheet: Y:\MIS_DATABASE\DATASHEETS\RESISTORS\RCXXXXL-SER_MAR18.PDF; Crtd /date: MANIRAJA/270117; Chkd/date: VASANTHA/270117; MECHANICAL 3D STEP FILE: RES0201_0-5; Footprint Path: Y:\MIS_DATABASE\Library\ALTIUM_TOOL\PCB_FOOTPRINTS\Altium_Footprint_Lib.PcbLib; Footprint Ref: RES0201_0-5; Library Path: Y:\MIS_DATABASE\Library\ALTIUM_TOOL\SCHEMATICS_PARTS\MS_DISCRETE_Library.schlib; PCB Footprint: RES0201_0-5
R561 R599 = RESISTOR_Dup6: RES 4.7K 1/20W 5% 0201; Part_type: RESISTORS\FIXED; Mfr_part_number: RC0201JR-074K7L; Mfr_name: YAGEO AMERICA; Mistral Part No: 110021090007-R; Custom_Duty: 15%; Customs_HS_Code: 85332119; Voltage: NA; Project: TI_AM62x SKEVM_BRD; Footprint Path: Y:\MIS_DATABASE\Library\ALTIUM_TOOL\PCB_FOOTPRINTS\Altium_Footprint_Lib.PcbLib; Library Path: Y:\MIS_DATABASE\Library\ALTIUM_TOOL\SCHEMATICS_PARTS\MS_DISCRETE_Library.schlib; MECHANICAL 3D STEP FILE: RES0201_0-5; Chkd/date: MANIRAJA/200921; Crtd /date: ALVY/200921; Datasheet: Y:\MIS_DATABASE\DATASHEETS\RESISTORS\RCXXXXL-SER_MAR18.PDF; Temperature: -55°C+125°C; Weight: 0.17mg; Height: 0.26MM; Footprint Ref: RES0201_0-5; Library Ref: RESISTOR; Distributor_part_number: 311-4.7KNCT-ND; Distributor_name: DIGIKEY; Package: 0201; Wattage: 1/20W; Tolerance: 5%; PCB Footprint: RES0201_0-5
R573 R611 = RESISTOR_Dup6: RES 4.7K 1/20W 5% 0201; Mistral Part No: 110021090007-R; Mfr_name: YAGEO AMERICA; Mfr_part_number: RC0201JR-074K7L; Part_type: RESISTORS\FIXED; Project: TI_AM62x SKEVM_BRD; Voltage: NA; Customs_HS_Code: 85332119; Custom_Duty: 15%; Tolerance: 5%; Wattage: 1/20W; Package: 0201; Distributor_name: DIGIKEY; Distributor_part_number: 311-4.7KNCT-ND; Library Ref: RESISTOR; Footprint Ref: RES0201_0-5; Height: 0.26MM; Weight: 0.17mg; Temperature: -55°C+125°C; Datasheet: Y:\MIS_DATABASE\DATASHEETS\RESISTORS\RCXXXXL-SER_MAR18.PDF; Crtd /date: ALVY/200921; Chkd/date: MANIRAJA/200921; MECHANICAL 3D STEP FILE: RES0201_0-5; Library Path: Y:\MIS_DATABASE\Library\ALTIUM_TOOL\SCHEMATICS_PARTS\MS_DISCRETE_Library.schlib; Footprint Path: Y:\MIS_DATABASE\Library\ALTIUM_TOOL\PCB_FOOTPRINTS\Altium_Footprint_Lib.PcbLib; PCB Footprint: RES0201_0-5
R593 = RESISTOR_Dup6: RES 12K 1/10W 1% 0402; Part_type: RESISTORS\FIXED; Mfr_part_number: ERJ-2RKF1202X; Mfr_name: PANASONIC-ECG; Mistral Part No: 110019040053-R; Custom_Duty: 15%; Customs_HS_Code: 85332119; Voltage: NA; Project: TI_C5545; Footprint Path: Y:\MIS_DATABASE\Library\ALTIUM_TOOL\PCB_FOOTPRINTS\Altium_Footprint_Lib.PcbLib; Library Path: Y:\MIS_DATABASE\Library\ALTIUM_TOOL\SCHEMATICS_PARTS\MS_DISCRETE_Library.schlib; MECHANICAL 3D STEP FILE: RES0402_0-5; Footprint Ref: RES0402_0-5; Chkd/date: VASANTHA/041215; Crtd /date: VASANTHA/041215; Datasheet: Y:\MIS_DATABASE\DATASHEETS\RESISTORS\PAN-ERJSER_NOV17.PDF; Temperature: -55°C+155°C; Weight: 0.8mg; Height: 0.40MM; Distributor_part_number: P12.0KLCT-ND; Distributor_name: DIGIKEY; Package: 0402; Wattage: 1/10W; Tolerance: 1%; Library Ref: RESISTOR; PCB Footprint: RES0402_0-5
R612 = RESISTOR_Dup6: RES 0E 1/8W 5% 0805; Part_type: RESISTORS\FIXED; Mfr_part_number: RC0805JR-070RL; Mfr_name: YAGEO AMERICA; Mistral Part No: 110009030074-R; Custom_Duty: 15%; Customs_HS_Code: 85332119; Voltage: NA; Project: ZK_BIOMETRIC; PCB Footprint: RES0805_0-75; MECHANICAL 3D STEP FILE: RES0805_0-75; Chkd/date: VASANTHA/130416; Crtd /date: JEBRAN/020316; Datasheet: Y:\MIS_DATABASE\DATASHEETS\RESISTORS\RCXXXXL-SER_MAR18.PDF; Temperature: -55°C+155°C; Weight: 5.5mg; Height: 0.60MM; Distributor_part_number: 311-0.0ARCT-ND; Distributor_name: DIGIKEY; Package: 0805; Wattage: 1/8W; Tolerance: 5%; Library Ref: RESISTOR; Footprint Ref: RES0805_0-75; Library Path: Y:\MIS_DATABASE\Library\ALTIUM_TOOL\SCHEMATICS_PARTS\MS_DISCRETE_Library.schlib; Footprint Path: Y:\MIS_DATABASE\Library\ALTIUM_TOOL\PCB_FOOTPRINTS\Altium_Footprint_Lib.PcbLib
TP57 TP58 = TESTPOINT: TESTPOINT 0.56MM DRILL PTH; Mfr_name: LOCAL; Mistral Part No: 130010010008; Project: KOPIN_MODULS; Tolerance: NA; Library Ref: TESTPOINT; Datasheet: NA; Chkd/date: BAVISH/040311; Crtd /date: MAZHAR/110405; Height: NA; Distributor_part_number: NA; Distributor_name: NA; Package: THRU-HOLE; Part_type: TESTPOINT; Mfr_part_number: TP_36X22; Voltage: NA; Wattage: NA; PCB Footprint: TP_36X22; Weight: NA; Temperature: NA
TP60 TP61 = TESTPOINT: TESTPOINT CIR 20 SMD; Mfr_name: LOCAL; Custom_Duty: NA; Project: BT MODULE_CSRBC04; Customs_HS_Code: NA; Footprint Path: Y:\MIS_DATABASE\Library\ALTIUM_TOOL\PCB_FOOTPRINTS\Altium_Footprint_Lib.PcbLib; Library Path: Y:\MIS_DATABASE\Library\ALTIUM_TOOL\SCHEMATICS_PARTS\MS_DISCRETE_Library.schlib; MECHANICAL 3D STEP FILE: NA; Datasheet: NA; Temperature: NA; Weight: NA; Wattage: NA; Voltage: NA; Tolerance: NA; Chkd/date: SHREESHAIL/171006; Crtd /date: MAZHAR/171006; Height: NA; Distributor_part_number: NA; Distributor_name: NA; Package: SMD; Part_type: TESTPOINT; Mfr_part_number: TP20_SMD; Mistral Part No: NA; Library Ref: TESTPOINT; Footprint Ref: TP20_SMD; RoHS: NA; PCB Footprint: TP20_SMD
U44 = TPD2E001DRLR_SOT-5: IC ESD-PROTECTION DIODE ARRAYS SOT-5; Mistral Part No: 140110060007-R; Mfr_name: TEXAS INSTRUMENTS; Part_type: ICS\ANALOG\ACTIVE FILTER; Project: CENTAURUS; Tolerance: NA; Customs_HS_Code: 85423100; Custom_Duty: 15%; Footprint Ref: SOT553-5_0-6; Mfr_part_number: TPD2E001DRLR; Voltage: NA; Wattage: NA; Package: SOT-5; Distributor_name: DIGIKEY; Distributor_part_number: 296-21883-1-ND; Library Ref: TPD2E001DRLR_SOT-5; Height: 0.60MM; Weight: 2.8mg; Temperature: -40°C+85°C; Datasheet: Y:\MIS_DATABASE\DATASHEETS\ICS\MISC\TPD2E001DRLR.PDF; Crtd /date: MUDDU/250510; Chkd/date: NAVEED/150714; MECHANICAL 3D STEP FILE: SOT553-5_0-6; Library Path: Y:\MIS_DATABASE\Library\ALTIUM_TOOL\SCHEMATICS_PARTS\MS_FILTER_Library.schlib; Footprint Path: Y:\MIS_DATABASE\Library\ALTIUM_TOOL\PCB_FOOTPRINTS\Altium_Footprint_Lib.PcbLib; PCB Footprint: SOT553-5_0-6
U46 = FT4232H_LQFP64: IC HIGH SPEED QUAD USB UART LQFP64; Part_type: ICS\DIGITAL\PERIPHERAL; Mfr_part_number: FT4232HL-REEL; Mfr_name: FTDI; Mistral Part No: 141013080006-R; PCB Footprint: LQFP64_19-68_390X390_1-6; Custom_Duty: 15%; Customs_HS_Code: 85423100; Wattage: NA; Project: DM37XX; Footprint Path: Y:\MIS_DATABASE\Library\ALTIUM_TOOL\PCB_FOOTPRINTS\Altium_Footprint_Lib.PcbLib; Library Path: Y:\MIS_DATABASE\Library\ALTIUM_TOOL\SCHEMATICS_PARTS\MS_COMBINATIONAL_Library.schlib; MECHANICAL 3D STEP FILE: LQFP64_19-68_390X390_1-6; Chkd/date: MANIRAJA/110917; Crtd /date: VIJAYALAKSHMI/120813; Datasheet: Y:\MIS_DATABASE\DATASHEETS\ICS\DIGITAL\PERIPHERAL\FT4232HX.PDF; Temperature: -40°C+85°C; Weight: 342.7mg; Height: 1.60MM; Footprint Ref: LQFP64_19-68_390X390_1-6; Library Ref: FT4232H_LQFP64; Distributor_part_number: 768-1026-1-ND; Distributor_name: DIGIKEY; Package: LQFP64; Voltage: NA; Tolerance: NA
U84 U93 = SN74AVC4T245RSV_UQFN16: IC 2-BIT BUS TRANSCEIVER WITH CONFIGURABLE VOLTAGE TRANSLATION AND 3 STATE O/P UQFN16; Mistral Part No: 141011040011-R; Mfr_name: TEXAS INSTRUMENTS; Part_type: ICS\DIGITAL\BUSTRANSCEIVER; Project: HMC; Tolerance: NA; Customs_HS_Code: 85423100; Custom_Duty: 15%; Library Ref: SN74AVC4T245RSV_UQFN16; Mfr_part_number: SN74AVC4T245RSVR; Voltage: NA; Wattage: NA; Package: UQFN16; Distributor_name: DIGIKEY; Distributor_part_number: 296-24366-1-ND; Height: 0.55MM; Weight: 41mg; Temperature: -40°C+85°C; Datasheet: Y:\MIS_DATABASE\DATASHEETS\ICS\DIGITAL\BUSTRANSCEIVER\SN74AVC4T245-SER.PDF; Crtd /date: BAVISH/190411; Chkd/date: MANIRAJA/040520; MECHANICAL 3D STEP FILE: UQFN16_TMUX1574_70X100_0-6; Footprint Ref: UQFN16_TMUX1574_70X100_0-6; Library Path: Y:\MIS_DATABASE\Library\ALTIUM_TOOL\SCHEMATICS_PARTS\MS_BUSDRIVERTRANSCEIVER_Library.schlib; Footprint Path: Y:\MIS_DATABASE\Library\ALTIUM_TOOL\PCB_FOOTPRINTS\Altium_Footprint_Lib.PcbLib; PCB Footprint: UQFN16_TMUX1574_70X100_0-6
U87 = 93LC46B_MSOP8: IC 1K MICROWIRE COMPATIBLE SERIAL EEPROM MSOP8; Part_type: ICS\DIGITAL\MEMORY; Mfr_part_number: 93LC46B-I/MS; Mfr_name: MICROCHIP; Mistral Part No: 141118020002-R; Custom_Duty: 15%; Customs_HS_Code: 85423100; Wattage: NA; Project: TI_MAXIE_CPB; Footprint Path: Y:\MIS_DATABASE\Library\ALTIUM_TOOL\PCB_FOOTPRINTS\Altium_Footprint_Lib.PcbLib; Library Path: Y:\MIS_DATABASE\Library\ALTIUM_TOOL\SCHEMATICS_PARTS\MS_MISCMEMORY_Library.schlib; MECHANICAL 3D STEP FILE: MSOP8_25-59_125X125_1-1; Chkd/date: MANIRAJA/150218; Crtd /date: ALVY/150218; Datasheet: Y:\MIS_DATABASE\DATASHEETS\ICS\MEMORY\93LC46B.PDF; Temperature: -40°C+85°C; Weight: 140mg; Height: 1.10MM; Distributor_part_number: 93LC46B-I/MS-ND; Distributor_name: DIGIKEY; Package: MSOP8; Voltage: NA; Tolerance: NA; Library Ref: 93LC46B_MSOP8; Footprint Ref: MSOP8_25-59_125X125_1-1; PCB Footprint: MSOP8_25-59_125X125_1-1
U92 U97 = SN74AVC4T245RSV_UQFN16: IC 2-BIT BUS TRANSCEIVER WITH CONFIGURABLE VOLTAGE TRANSLATION AND 3 STATE O/P UQFN16; Part_type: ICS\DIGITAL\BUSTRANSCEIVER; Mfr_name: TEXAS INSTRUMENTS; Mistral Part No: 141011040011-R; Custom_Duty: 15%; Customs_HS_Code: 85423100; Wattage: NA; Project: HMC; Footprint Path: Y:\MIS_DATABASE\Library\ALTIUM_TOOL\PCB_FOOTPRINTS\Altium_Footprint_Lib.PcbLib; Library Path: Y:\MIS_DATABASE\Library\ALTIUM_TOOL\SCHEMATICS_PARTS\MS_BUSDRIVERTRANSCEIVER_Library.schlib; Footprint Ref: UQFN16_TMUX1574_70X100_0-6; MECHANICAL 3D STEP FILE: UQFN16_TMUX1574_70X100_0-6; Chkd/date: MANIRAJA/040520; Crtd /date: BAVISH/190411; Datasheet: Y:\MIS_DATABASE\DATASHEETS\ICS\DIGITAL\BUSTRANSCEIVER\SN74AVC4T245-SER.PDF; Temperature: -40°C+85°C; Weight: 41mg; Height: 0.55MM; Distributor_part_number: 296-24366-1-ND; Distributor_name: DIGIKEY; Package: UQFN16; Voltage: NA; Tolerance: NA; Mfr_part_number: SN74AVC4T245RSVR; Library Ref: SN74AVC4T245RSV_UQFN16; PCB Footprint: UQFN16_TMUX1574_70X100_0-6
U95 = TPS73501DRVR_SON6: IC 500mA LOW DROPOUT REGULATOR SON6; Part_type: ICS\POWER\VOLTAGE REGULATOR; Mfr_name: TEXAS INSTRUMENTS; Mistral Part No: 142014100001-R; Custom_Duty: 15%; Customs_HS_Code: 85423100; Wattage: NA; Project: BLUETOOTH_WATCH; Library Ref: TPS73501DRVR_SON6; Chkd/date: VASANTHA/280915; Crtd /date: NAVEED/011014; Datasheet: Y:\MIS_DATABASE\DATASHEETS\ICS\POWER\TPS735.PDF; Temperature: -40°C+125°C; Weight: NA; Height: 0.80MM; Distributor_part_number: TPS73533DRVR-ND; Distributor_name: DIGIKEY; Package: SON6; Voltage: NA; Tolerance: NA; Mfr_part_number: TPS73533DRVR; PCB Footprint: SON6_25-59_85X85
Y3 = CRY4_13: CRY 12.000MHz 18pF SMD; Mistral Part No: 130021100037-R; Mfr_name: ECS INC; Mfr_part_number: ECS-120-18-30B-AGN-TR; Part_type: CRYSTAL; Project: TI_AM62x SKEVM_BRD; Tolerance: NA; Customs_HS_Code: 85439000; Custom_Duty: 24%; Footprint Ref: XTAL4_ECX-53BQ_200X130_SMD_0-9; Voltage: NA; Wattage: NA; Package: SMD; Distributor_name: DIGIKEY; Distributor_part_number: XC2719CT-ND; Library Ref: CRY4_13; Height: 0.85MM; Weight: 159.425mg; Temperature: -40°C+85°C; Datasheet: Y:\MIS_DATABASE\DATASHEETS\MISC\CRY_OSC\ECS-53B.PDF; Crtd /date: ALVY/271021; Chkd/date: MANIRAJA/271021; MECHANICAL 3D STEP FILE: XTAL4_ECX-53BQ_200X130_SMD_0-9; Library Path: Y:\MIS_DATABASE\Library\ALTIUM_TOOL\SCHEMATICS_PARTS\MS_DISCRETE_Library.schlib; Footprint Path: Y:\MIS_DATABASE\Library\ALTIUM_TOOL\PCB_FOOTPRINTS\Altium_Footprint_Lib.PcbLib; PCB Footprint: XTAL4_ECX-53BQ_200X130_SMD_0-9